# Altium schematic sheet Motor Controller Interface.SchDoc
size A4; Organization: TESLA Motors, INC; Address1: 3500 Deer Creek Road; Address2: Palo Alto, CA; Address4: U.S.A.; SheetNumber: 4; SheetTotal: 9
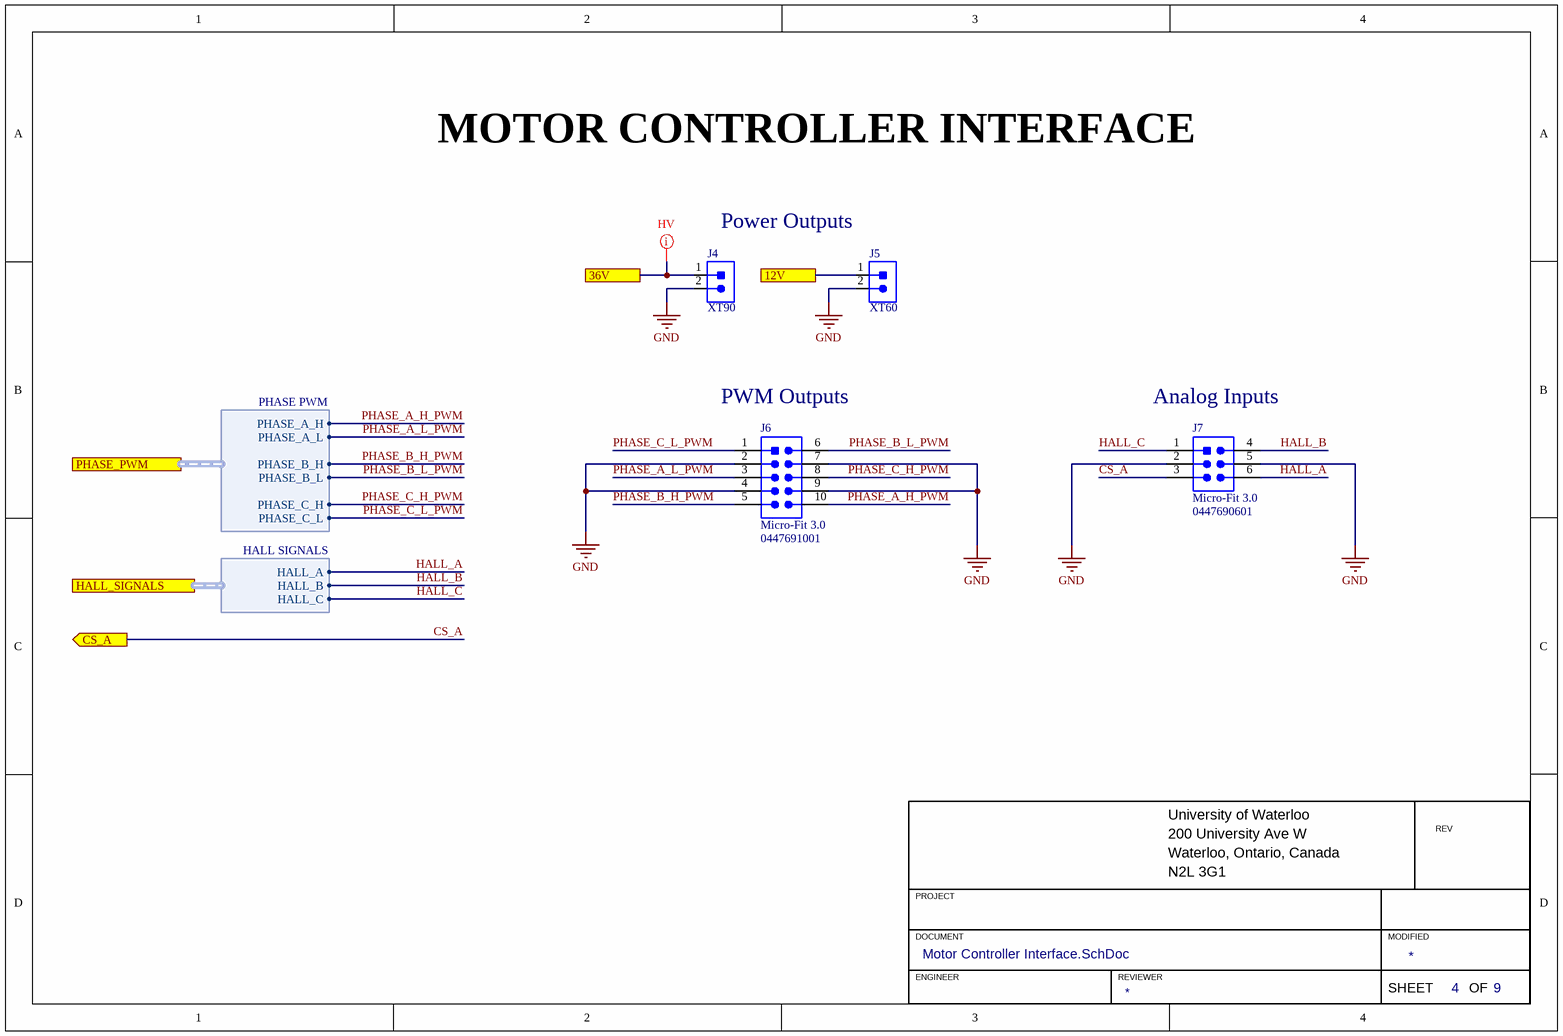
[diagram p0: Motor Controller Interface.SchDoc]

## Parts
J4  CON_2POS_XT90  [XT90]  (value not drawn)
J5  CON_2POS_XT60  [XT60]  (value not drawn)
J6  Family: Micro-Fit 3.0  [MOLEX-0447691001]  (hidden comment: 0447691001)
J7  Family: Micro-Fit 3.0  [MOLEX-0447690601]  (hidden comment: 0447690601)

## Ports
12V, 36V, CS_A (out), HALL_SIGNALS (harness HALL SIGNALS), PHASE_PWM (harness PHASE PWM)

## Harnesses
PHASE PWM: PHASE_A_H, PHASE_A_L, PHASE_B_H, PHASE_B_L, PHASE_C_H, PHASE_C_L
HALL SIGNALS: HALL_A, HALL_B, HALL_C

## Nets
GND: J4.2 J5.2 J6.2 J6.4 J6.7 J6.9 J7.2 J7.5
12V: J5.1 ; port 12V
36V: J4.1 ; port 36V
CS_A: J7.3 ; port CS_A
HALL_A: J7.6 ; port HALL_SIGNALS.HALL_A
HALL_B: J7.4 ; port HALL_SIGNALS.HALL_B
HALL_C: J7.1 ; port HALL_SIGNALS.HALL_C
PHASE_A_H_PWM: J6.10 ; port PHASE_PWM.PHASE_A_H
PHASE_A_L_PWM: J6.3 ; port PHASE_PWM.PHASE_A_L
PHASE_B_H_PWM: J6.5 ; port PHASE_PWM.PHASE_B_H
PHASE_B_L_PWM: J6.6 ; port PHASE_PWM.PHASE_B_L
PHASE_C_H_PWM: J6.8 ; port PHASE_PWM.PHASE_C_H
PHASE_C_L_PWM: J6.1 ; port PHASE_PWM.PHASE_C_L

## Layout directives
net class HV: 36V

## Notes on the sheet
- MOTOR CONTROLLER INTERFACE
- Power Outputs
- (near J6) PWM Outputs
- (near J7) Analog Inputs
- University of Waterloo
- 200 University Ave W
- REV
- PROJECT
- Waterloo, Ontario, Canada
- N2L 3G1
- DOCUMENT
- ENGINEER
- REVIEWER
- MODIFIED
- SHEET
- OF

## Library data of the parts
J4 = CON_2POS_XT90: HIGH QUALITY GOLD PLATED XT90 MA; Manufacturer 1: DFRobot; Manufacturer Part Number 1: FIT0588; Mounting Type: TH; Package/Footprint: XT90; Supplier 1: Digi-Key; Supplier Part Number 1: 1738-1438-ND
J5 = CON_2POS_XT60: XT60 CONNECTORS MALE/FEMALE PAIR; Manufacturer 1: SparkFun Electronics; Manufacturer Part Number 1: PRT-10474; Mounting Type: TH; Package/Footprint: XT60; Supplier 1: Digi-Key; Supplier Part Number 1: 1568-1816-ND
J6 = CON_MOLEX-RCPT_5x2_TH: CONN RCPT 10POS 0.118 TIN PCB; Manufacturer 1: Molex; Voltage Rating: 250VAC; Current Rating: 5A; Pitch: 3mm; Supplier 1: Digi-Key; Supplier Part Number 1: WM1956-ND; Manufacturer Part Number 1: 0447691001
J7 = CON_MOLEX-RCPT_3x2_TH: CONN RCPT 6POS 0.118 TIN PCB; Manufacturer 1: Molex; Voltage Rating: 250VAC; Current Rating: 5A; Pitch: 3mm; Supplier 1: Digi-Key; Supplier Part Number 1: 23-0447690601-ND; Manufacturer Part Number 1: 0447690601